# EAGLE design Simon (EAGLE 5.10)
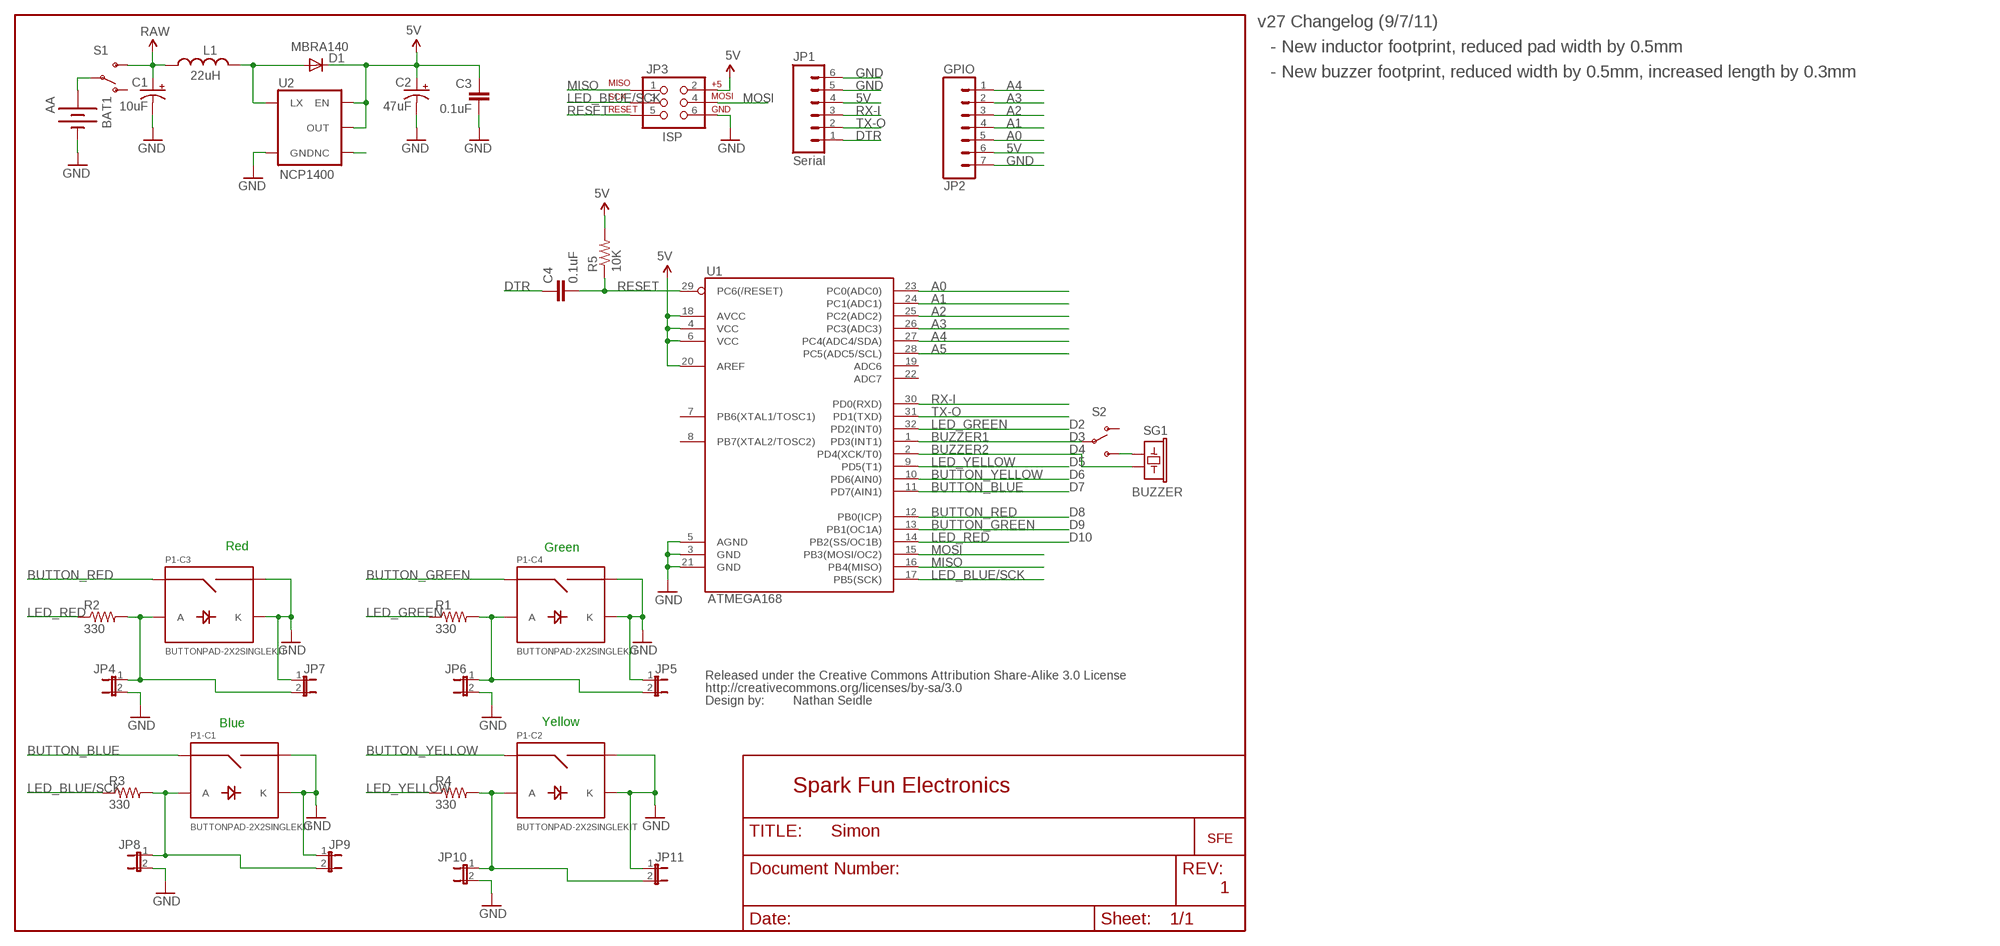
[diagram p0: schematic, sheet 1]

## Parts
BAT1  AA  BATTERYAA-KIT  [BATTERY-AA-KIT]
C1  10uF  CAP_POL1206-KIT  [EIA3216-KIT]
C2  47uF  CAP_POL3528-KIT  [EIA3528-KIT]
C3  0.1uF  CAP0603-CAP  [0603-CAP]
C4  0.1uF  CAP0603-CAP  [0603-CAP]
D1  MBRA140  DIODESMA-KIT  [SMA-DIODE-KIT]
JP1  Serial  M06SIP  [1X06]
JP2  GPIO  M07  [1X07]
JP3  ISP  AVR_SPI_PRG_6PTH  [2X3]
JP4  JUMPER-2SMD-NO-NS  [SJ_2S-NO-NS]
JP5  JUMPER-2NOSILK  [SJ_2S_NO_SILK]
JP6  JUMPER-2NOSILK  [SJ_2S_NO_SILK]
JP7  JUMPER-2SMD-NO-NS  [SJ_2S-NO-NS]
JP8  JUMPER-2SMD-NO-NS  [SJ_2S-NO-NS]
JP9  JUMPER-2SMD-NO-NS  [SJ_2S-NO-NS]
JP10  JUMPER-2NOSILK  [SJ_2S_NO_SILK]
JP11  JUMPER-2NOSILK  [SJ_2S_NO_SILK]
L1  22uH  INDUCTORCR54-KIT  [CR54-KIT]
P1-  BUTTONPAD-2X2SINGLEKIT  [BUTTONPAD-2X2SINGLE-KIT]
R1  330  RESISTOR0603-RES  [0603-RES]
R2  330  RESISTOR0603-RES  [0603-RES]
R3  330  RESISTOR0603-RES  [0603-RES]
R4  330  RESISTOR0603-RES  [0603-RES]
R5  10K  RESISTOR0603-RES  [0603-RES]
S1  SWITCH-SPSTKIT  [SWITCH-SPDT_KIT]
S2  SWITCH-SPSTKIT  [SWITCH-SPDT_KIT]
SG1  BUZZER  BUZZERSMD2-KIT  [BUZZER-CCV-KIT]
U1  ATMEGA168  [TQFP32-08]
U2  NCP1400  V-REG-NCP1400SOT23-5  [SOT23-5]
U$1  LOGO-SFENEW  [SFE-NEW-WEBLOGO]
U$2  CREATIVE_COMMONS  [CREATIVE_COMMONS]

## Nets
5V: C2.A(+) C3.1 D1.C JP1.4 JP2.6 JP3.2 R5.2 U1.4(VCC) U1.6(VCC) U1.18(AVCC) U1.20(AREF) U2.1(EN) U2.2(OUT)
A0: JP2.5 U1.23(PC0(ADC0))
A1: JP2.4 U1.24(PC1(ADC1))
A2: JP2.3 U1.25(PC2(ADC2))
A3: JP2.2 U1.26(PC3(ADC3))
A4: JP2.1 U1.27(PC4(ADC4/SDA))
A5: U1.28(PC5(ADC5/SCL))
BUTTON_BLUE [ButtonSignal]: P1-.SIG1(C1:SIG1) U1.11(PD7(AIN1))
BUTTON_GREEN: P1-.SIG7(C4:SIG1) U1.13(PB1(OC1A))
BUTTON_RED [ButtonSignal]: P1-.SIG5(C3:SIG1) U1.12(PB0(ICP))
BUTTON_YELLOW [ButtonSignal]: P1-.SIG3(C2:SIG1) U1.10(PD6(AIN0))
BUZZER1: S2.2(P) U1.1(PD3(INT1))
BUZZER2: SG1.- U1.2(PD4(XCK/T0))
DTR: C4.1 JP1.1
GND: BAT1.GND@1(-) C1.C(-) C2.C(-) C3.2 JP1.5 JP1.6 JP2.7 JP3.6 JP4.2 JP5.1 JP6.2 JP7.1 JP8.2 JP9.1 JP10.2 JP11.1 P1-.K1(C1:K) P1-.K2(C2:K) P1-.K3(C3:K) P1-.K4(C4:K) P1-.SIG2(C1:SIG2) P1-.SIG4(C2:SIG2) P1-.SIG6(C3:SIG2) P1-.SIG8(C4:SIG2) U1.3(GND) U1.5(AGND) U1.21(GND) U2.4(GND)
LED_BLUE/SCK: JP3.3 R3.1 U1.17(PB5(SCK))
LED_GREEN: R1.1 U1.32(PD2(INT0))
LED_RED: R2.1 U1.14(PB2(SS/OC1B))
LED_YELLOW: R4.1 U1.9(PD5(T1))
MISO: JP3.1 U1.16(PB4(MISO))
MOSI: JP3.4 U1.15(PB3(MOSI/OC2))
N$1: JP5.2 JP6.1 P1-.A4(C4:A) R1.2
N$2: BAT1.PWR@1(+) S1.2(P)
N$3: S2.3(S) SG1.+
N$4: JP10.1 JP11.2 P1-.A2(C2:A) R4.2
N$5: JP4.1 JP7.2 P1-.A3(C3:A) R2.2
N$6: JP8.1 JP9.2 P1-.A1(C1:A) R3.2
N$16: D1.A L1.P$1 U2.5(LX)
NC: U2.3(NC)
RAW: C1.A(+) L1.P$2 S1.3(S)
RESET: C4.2 JP3.5 R5.1 U1.29(PC6(/RESET))
RX-I: JP1.3 U1.30(PD0(RXD))
TX-O: JP1.2 U1.31(PD1(TXD))
Unconnected: S1.1(O) S2.1(O) U1.7(PB6(XTAL1/TOSC1)) U1.8(PB7(XTAL2/TOSC2)) U1.19(ADC6) U1.22(ADC7)

## Notes on the sheet
- v27 Changelog (9/7/11)
- - New inductor footprint, reduced pad width by 0.5mm
- - New buzzer footprint, reduced width by 0.5mm, increased length by 0.3mm
- D2
- D3
- D4
- D5
- D6
- D7
- D8
- D9
- D10
- Red | Green
- Nathan Seidle
- Blue | Yellow
- Spark Fun Electronics
- 1

## Library data of the parts
BAT1 = SparkFun:BATTERY: Battery Holders Various common sizes : AA, AAA, 20mm coin cell and 12mm coin cell.
C1 C2 = SparkFun:CAP_POL: Capacitor Polarized These are standard SMD and PTH capacitors. Normally 10uF, 47uF, and 100uF in electrolytic and tantalum varieties. Always verify the external diameter of the through hole cap, it varies with capacity, voltage, and manufacturer. The EIA devices should be standard.
C3 C4 = SparkFun:CAP: Capacitor Standard 0603 ceramic capacitor, and 0.1" leaded capacitor.
D1 = SparkFun:DIODE: Diode These are standard reverse protection diodes and small signal diodes. SMA package can handle up to about 1A. SOD-323 can handle about 200mA. What the SOD-323 package when ordering, there are some mfgs out there that are 5-pin packages.
JP1 = SparkFun:M06: Header 6 Standard 6-pin 0.1" header. Use with straight break away headers (SKU : PRT-00116), right angle break away headers (PRT-00553), swiss pins (PRT-00743), machine pins (PRT-00117), and female headers (PRT-00115). Molex polarized connector foot print use with SKU : PRT-08094 with associated crimp pins and housings. NOTES ON THE VARIANTS LOCK and LOCK_LONGPADS... This footprint was designed to help hold the alignment of a through-hole component (i.e. 6-pin header) while soldering it into place. You may notice that each hole has been shifted either up or down by 0.005 of an inch from it's more standard position (which is a perfectly straight line). This slight alteration caused the pins (the squares in the middle) to touch the edges of the holes. Because they are alternating, it causes a "brace" to hold the component in place. 0.005 has proven to be the perfect amount of "off-center" position when using our standard breakaway headers. Although looks a little odd when you look at the bare footprint, once you have a header in there, the alteration is very hard to notice. Also, if you push a header all the way into place, it is covered up entirely on the bottom side. This idea of altering the position of holes to aid alignment will be further integrated into the Sparkfun Library for other footprints. It can help hold any component with 3 or more connection pins.
JP2 = SparkFun:M07: Header 7 Standard 7-pin 0.1" header. Use with straight break away headers (SKU : PRT-00116), right angle break away headers (PRT-00553), swiss pins (PRT-00743), machine pins (PRT-00117), and female headers (PRT-00115). NOTES ON THE VARIANTS LOCK and LOCK_LONGPADS... This footprint was designed to help hold the alignment of a through-hole component (i.e. 7-pin header) while soldering it into place. You may notice that each hole has been shifted either up or down by 0.005 of an inch from it's more standard position (which is usually a perfectly straight line). This slight alteration caused the pins (the squares in the middle) to touch the edges of the holes. Because they are alternating, it causes a "brace" to hold the header in place. 0.005 has proven to be the perfect amount of "off-center" position when using our standard breakaway headers. Although looks a little odd when you look at the bare footprint, once you have a header in there, the alteration is very hard to notice. Also, if you push a header all the way into place, it is covered up entirely on the bottom side. This idea of altering the position of holes to aid alignment will be further integrated into the Sparkfun Library for other footprints. It can help hold any component with 3 or more connection pins.
JP3 = SparkFun:AVR_SPI_PRG_6: AVR ISP 6 Pin This is the reduced ISP connector for AVR programming. Common on Arduino. This footprint will take up less PCB space and can be used with a 10-pin to 6-pin adapter such as SKU: BOB-08508
JP4 JP7-JP9 = SparkFun:JUMPER-2: Jumper Basic 0.1" spaced jumper. Use with breakaway headers.
JP5 JP6 JP10 JP11 = unclepetes:JUMPER-2: Jumper Basic 0.1" spaced jumper. Use with breakaway headers.
L1 = SparkFun:INDUCTOR: Inductors Basic Inductor/Choke - 0603 and 1206. Footprints are not proven and vary greatly between part numbers.
P1- = SparkFun:BUTTONPAD-2X2SINGLE: 5mm Button Pad Proto layout and schematic for 2x2 button pad with single color LEDs (used on Simon board). Panelize this device/fp to a 4x4 pad if needed. Any single-color 5mm LED should be compatible. Spark Fun Electronics SKU : COM-07835.
R1-R5 = SparkFun:RESISTOR: Resistor Basic schematic elements and footprints for 0603, 1206, and PTH resistors.
S1 S2 = SparkFun:SWITCH-SPST: SPST Switch Simple slide switch. Spark Fun Electronics SKU : COM-00102
SG1 = SparkFun:BUZZER: Buzzer 12mm Spark Fun Electronics SKU : Comp-Buzzer
U1 = SparkFun:ATMEGA168
U2 = SparkFun-Nate:V-REG-NCP1400
U$1 = SparkFun:LOGO-SFE: Spark Fun Electronics PCB Logo This is the standard Spark Fun Electronics PCB logo.
U$2 = SparkFun:CREATIVE_COMMONS

## Net classes
0 Default: width 0.254 mm
1 Power: width 0.305 mm
3 ButtonSignal: width 0.203 mm

## Board
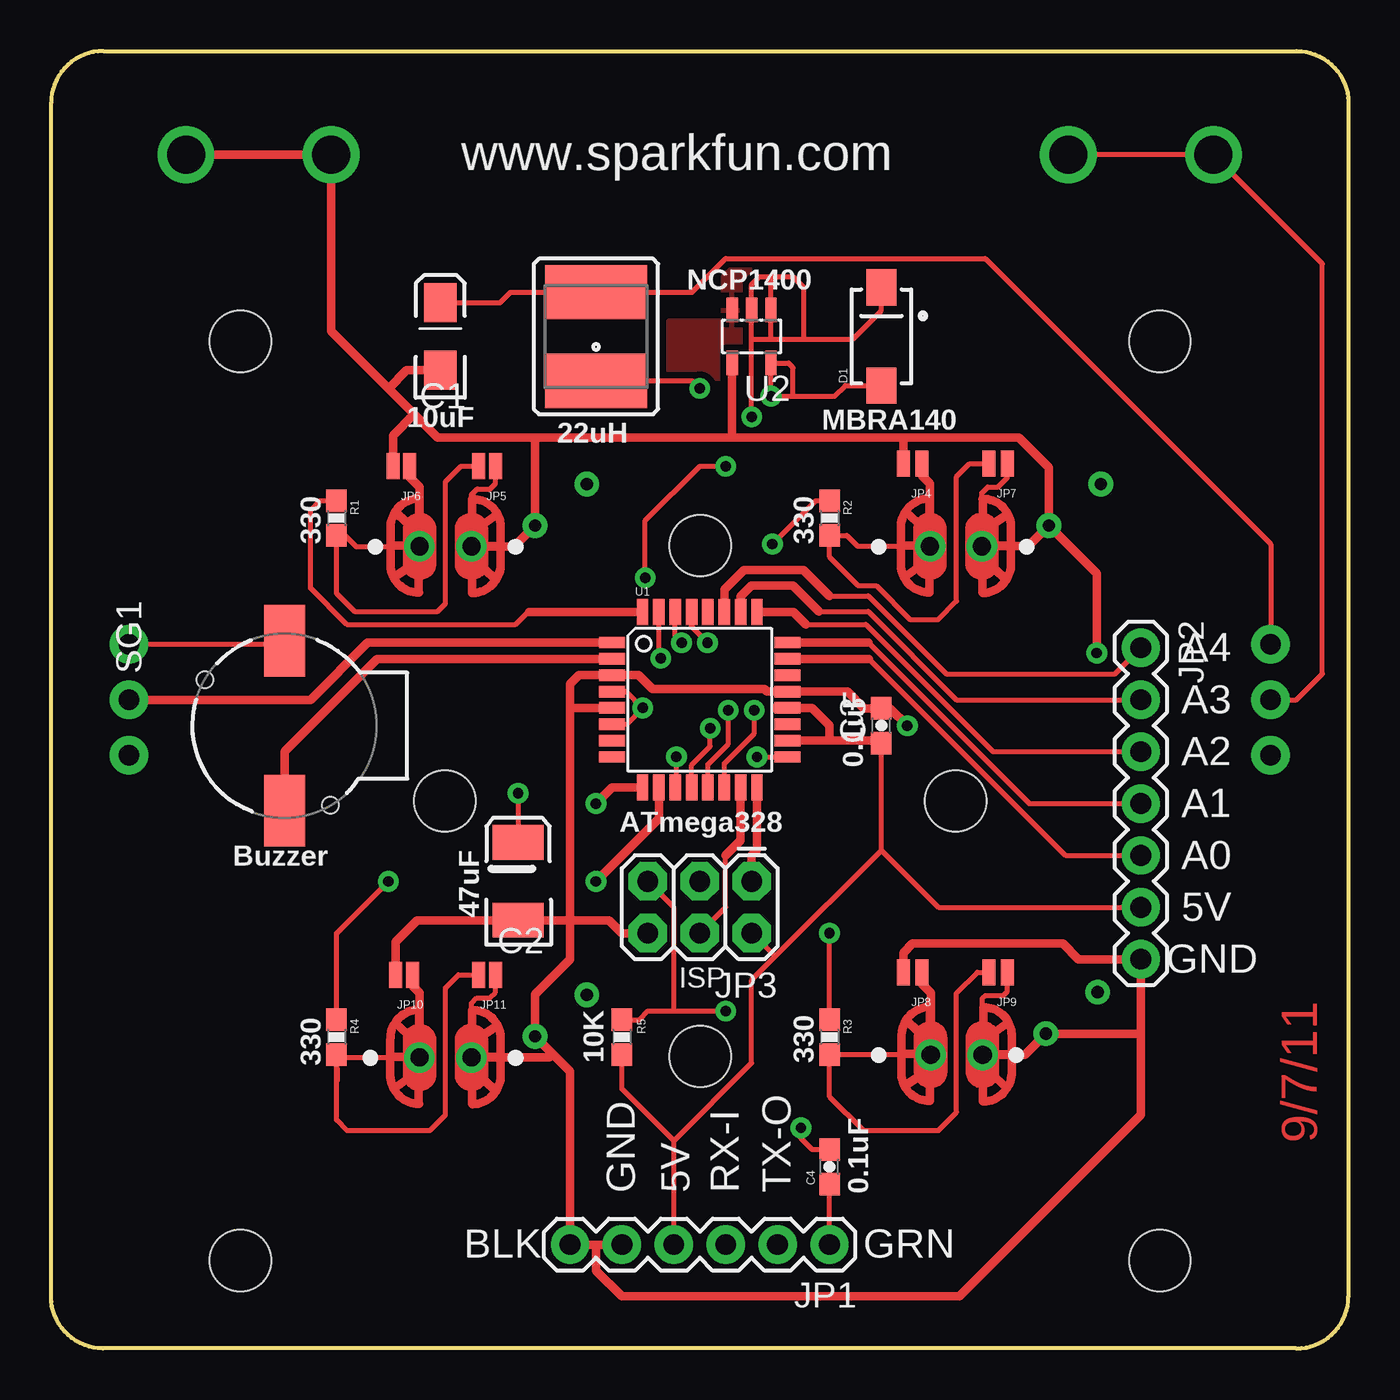
[diagram p1: board, top side]
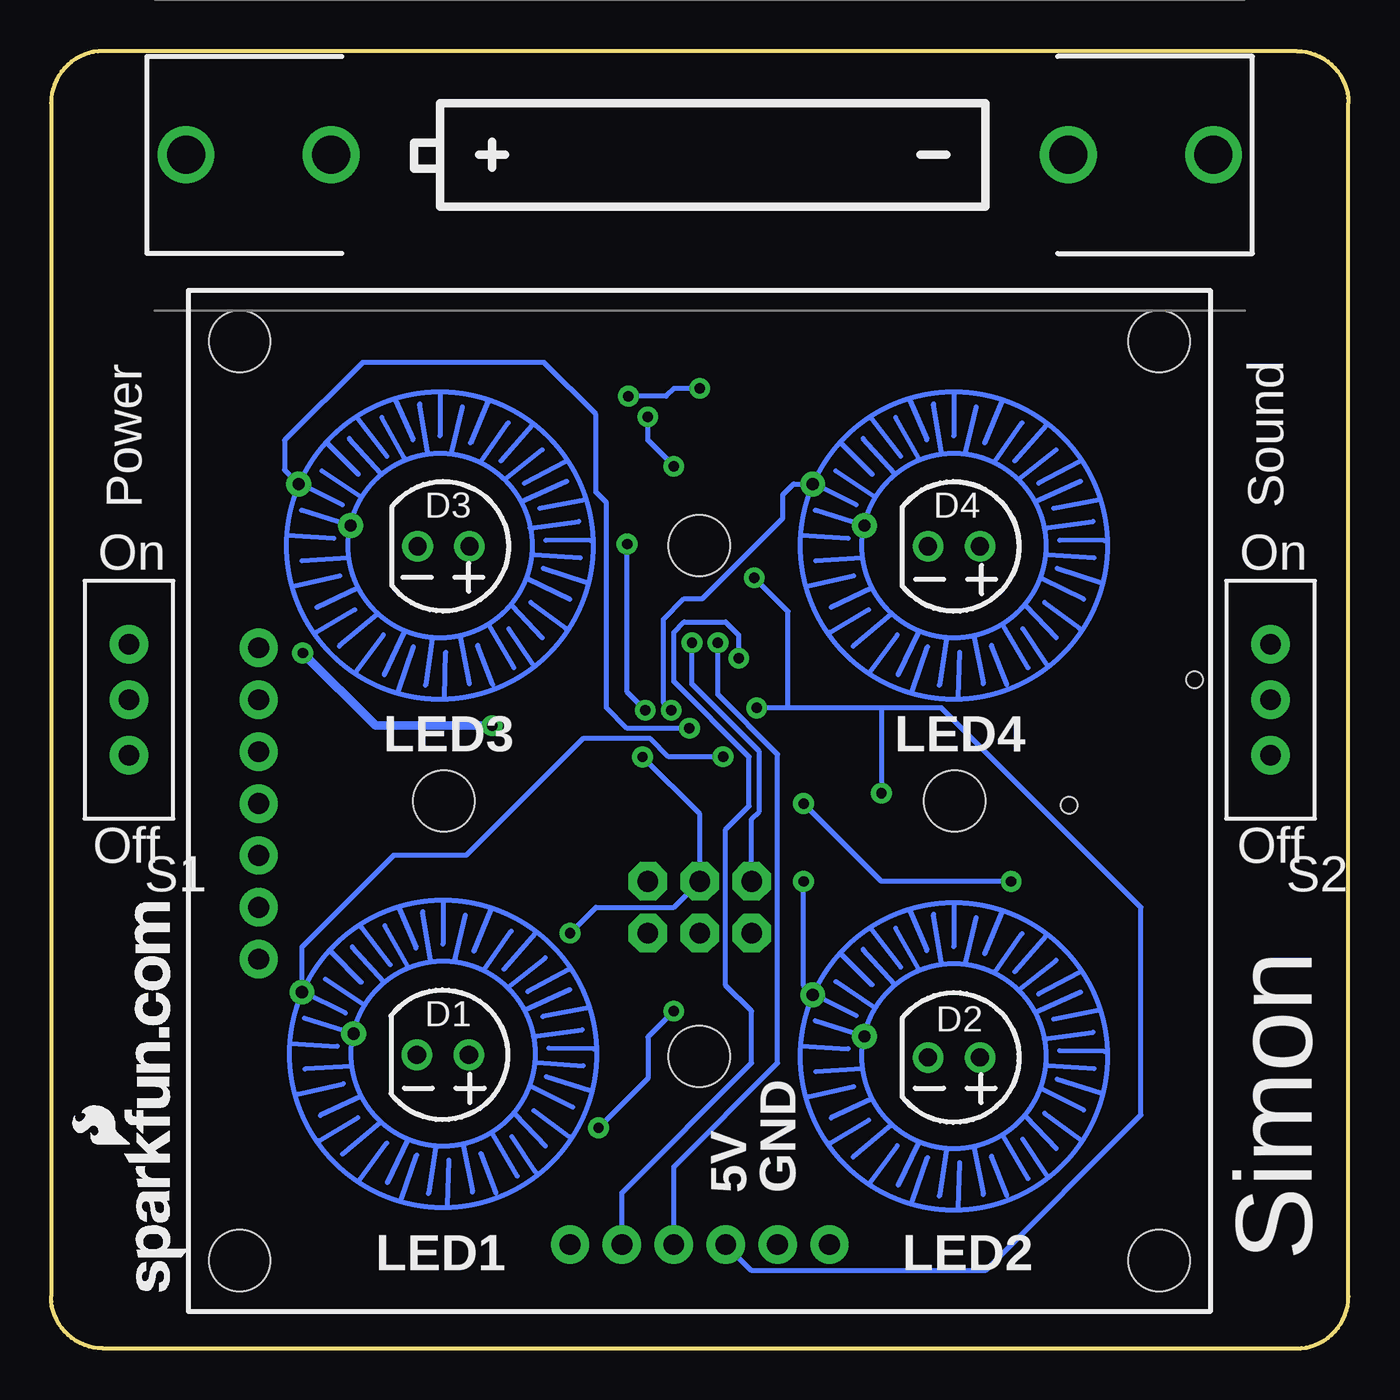
[diagram p2: board, bottom side, seen from below]

Size 63.5 x 63.5 mm. Coordinates in mm from the lower left corner, seen from the top.
Outline: 60.96,0 arc90 63.5,2.54 63.5,60.96 arc90 60.96,63.5 2.54,63.5 arc90 0,60.96 0,2.54 arc90 2.54,0 60.96,0
Copper layers (1*16): Top 0.035mm / dielectric 1.5mm / Bottom 0.035mm
Design rules "SparkFun *": minimum track width 8mil, minimum drill 20mil, track to track 8mil, track to pad 8mil, pad to pad 8mil, via to via 8mil, smd to smd 8mil, copper to edge 10mil, drill to drill 8mil, minimum pad ring 12mil, minimum via ring 10mil, stop-mask expansion 4mil, vias tented up to drill 25mil, thermal gap 10mil

### Footprints (pad centres in the part's own frame; a part is rotated, then mirrored left to right if it is on the bottom)
BATTERY-AA-KIT = drill 1.854 round: GND@1 25.146,0; GND@2 18.034,0; PWR@1 -25.146,0; PWR@2 -18.034,0
EIA3216-KIT = smd 1.9 x 1.6: A 1.65,0; C -1.65,0
EIA3528-KIT = smd 1.7 x 2.5: A 1.9,0; C -1.9,0
0603-CAP = smd 1.1 x 1: 1 -0.85,0; 2 0.85,0
SMA-DIODE-KIT = smd 1.77 x 1.47: A -2.4,0; C 2.4,0
1X06 = drill 1.016 pad 1.88 round: 1 0,0; 2 2.54,0; 3 5.08,0; 4 7.62,0; 5 10.16,0; 6 12.7,0
1X07 = drill 1.016 pad 1.88 round: 1 0,0; 2 2.54,0; 3 5.08,0; 4 7.62,0; 5 10.16,0; 6 12.7,0; 7 15.24,0
2X3 = drill 1.016 pad 1.88 octagon: 1 0,0; 2 0,2.54; 3 2.54,0; 4 2.54,2.54; 5 5.08,0; 6 5.08,2.54
SJ_2S-NO-NS = smd 0.635 x 1.27: 1 -0.45,0; 2 0.45,0
SJ_2S_NO_SILK = smd 0.635 x 1.27: 1 -0.412,0; 2 0.412,0
CR54-KIT = smd 5 x 2.65: P$1 0,2.17; P$2 0,-2.17
BUTTONPAD-2X2SINGLE-KIT = drill 0.889 pad 1.016 round: A1 13.716,12.573; A2 38.735,12.446; A3 13.75,37.47; A4 38.735,37.465; K1 11.176,12.573; K2 36.195,12.446; K3 11.21,37.47; K4 36.195,37.465 | drill 0.6 round: SIG1 5.542,15.64; SIG2 8.082,13.608; SIG3 30.542,15.513; SIG4 33.082,13.481; SIG5 5.388,40.513; SIG6 7.928,38.481; SIG7 30.542,40.513; SIG8 33.082,38.481 | hole 3: 12.5,25; 25,37.5; 37.5,25; 25,12.5; 2.5,2.5; 2.5,47.5; 47.5,47.5; 47.5,2.5
0603-RES = smd 1.1 x 1: 1 -0.85,0; 2 0.85,0
SWITCH-SPDT_KIT = drill 1.016 pad 1.88 round: 1 0,2.718; 2 0,0; 3 0,-2.718
BUZZER-CCV-KIT = smd 3.5 x 2: + 4.15,0; - -4.15,0 | hole 0.8: -3.9,-2.25; 2.25,3.9
TQFP32-08 = smd 1.27 x 0.559: 1 -4.293,2.8; 2 -4.293,2; 3 -4.293,1.2; 4 -4.293,0.4; 5 -4.293,-0.4; 6 -4.293,-1.2; 7 -4.293,-2; 8 -4.293,-2.8; 17 4.293,-2.8; 18 4.293,-2; 19 4.293,-1.2; 20 4.293,-0.4; 21 4.293,0.4; 22 4.293,1.2; 23 4.293,2; 24 4.293,2.8 | smd 0.559 x 1.27: 9 -2.8,-4.293; 10 -2,-4.293; 11 -1.2,-4.293; 12 -0.4,-4.293; 13 0.4,-4.293; 14 1.2,-4.293; 15 2,-4.293; 16 2.8,-4.293; 25 2.8,4.293; 26 2,4.293; 27 1.2,4.293; 28 0.4,4.293; 29 -0.4,4.293; 30 -1.2,4.293; 31 -2,4.293; 32 -2.8,4.293
SOT23-5 = smd 0.55 x 1.2: 1 -0.95,-1.3; 2 0,-1.3; 3 0.95,-1.3; 4 0.95,1.3; 5 -0.95,1.3

### Placement (x,y rotation side)
BAT1  31.75,58.42 0 bottom
C1  19.05,49.53 90 top
C2  22.86,22.86 90 top
C3  40.64,30.48 90 top
C4  38.1,8.89 90 top
D1  40.64,49.53 90 top
JP1  38.1,5.08 180 top
JP2  53.34,34.29 270 top
JP3  34.29,22.86 180 top
JP4  42.16,43.31 180 top
JP5  21.34,43.18 180 top
JP6  17.14,43.18 180 top
JP7  46.35,43.31 180 top
JP8  42.16,18.41 180 top
JP9  46.35,18.41 180 top
JP10  17.27,18.29 180 top
JP11  21.34,18.29 180 top
L1  26.67,49.53 180 top
P1-  56.77,1.79 0 bottom
R1  13.97,40.64 270 top
R2  38.1,40.64 270 top
R3  38.1,15.24 270 top
R4  13.97,15.24 270 top
R5  27.94,15.24 270 top
S1  59.69,31.75 180 bottom
S2  3.81,31.75 180 bottom
SG1  11.43,30.48 90 top
U1  31.75,31.75 0 top
U2  34.29,49.53 180 top
U$1  56.77,2.79 90 bottom
U$2  16.51,-16.51 0 top  (outside the outline)

### Tracks (layer width: path | path; a pad name or v marks a point on that pad's centre or on a via)
5V  (via drill 0.51)
  Top 0.254: D1.C 40.64,50.8 39.24,49.4 35.24,49.4 | v22.86,27.18 C2.A | v29.08,37.72 29.08,40.51 31.75,43.18 v33.02,43.18 | 35.41,31.35 U1.20 | U1.6 28.16,30.55 v28.96,31.35 28.16,32.15 U1.4 | 40.64,24.38 C3.1 | 35.43,19.18 40.64,24.38 | 35.43,19.18 JP3.2 | 35.18,52.45 36.32,52.45 36.83,51.94 36.83,49.4 | 35.18,52.45 34.67,52.45 34.29,52.07 U2.2 34.29,49.4 | 35.18,52.45 35.24,52.39 U2.1 35.24,49.4 | v34.29,45.59 34.29,49.4 | 34.29,49.4 35.24,49.4 | R5.2 27.94,12.7 30.48,10.16 | JP1.4 30.48,10.16 | 35.43,19.18 34.29,18.03 34.29,13.97 30.48,10.16 | 40.64,24.38 43.43,21.59 JP2.6
  Top 0.406: 38.1,29.75 40.52,29.75 C3.1 | 38.1,29.75 U1.18 | 35.41,31.35 37.23,31.35 38.1,30.48 38.1,29.75
  Bottom 0.254: v33.02,43.18 34.29,44.45 v34.29,45.59 | 27.43,31.35 v28.96,31.35 | v29.08,37.72 27.43,36.07 27.43,31.35 | JP1.4 29.21,3.81 17.78,3.81 10.16,11.43 10.16,21.59 19.92,31.35 22.86,31.35 | 22.86,31.35 27.43,31.35 | 22.86,31.35 v22.86,27.18
A0
  Top 0.254: JP2.5 49.66,24.13 40.04,33.75
  Top 0.406: U1.23 40.04,33.75
A1
  Top 0.254: JP2.4 47.88,26.67 40,34.55
  Top 0.406: U1.24 40,34.55
A2
  Top 0.254: JP2.3 46.1,29.21 39.88,35.43 36.96,35.43
  Top 0.406: U1.25 36.35,36.04 36.96,35.43
A3
  Top 0.254: JP2.2 44.32,31.75 40.01,36.07 37.59,36.07
  Top 0.406: U1.26 33.75,36.8 34.29,37.34 36.32,37.34 37.59,36.07
A4
  Top 0.254: JP2.1 52.07,33.02 43.81,33.02 40.01,36.83 38.1,36.83
  Top 0.406: U1.27 32.95,37.14 33.91,38.1 36.83,38.1 38.1,36.83
BUTTON_BLUE  (via drill 0.51)
  Top 0.254: U1.11 30.61,27.51 v30.61,28.96
  Bottom 0.254: P1-.SIG1 51.23,19.64 46.74,24.13 43.18,24.13 37.47,29.84 34.16,29.84 33.27,28.96 v30.61,28.96
BUTTON_GREEN  (via drill 0.51)
  Top 0.254: U1.13 32.15,28.59 33.15,29.59 v33.15,31.24
  Bottom 0.254: P1-.SIG7 27.16,42.31 27.69,41.78 27.69,40.64 31.62,36.7 32.51,36.7 33.53,35.69 33.53,31.62 v33.15,31.24
BUTTON_RED  (via drill 0.51)
  Top 0.254: v32.26,30.35 32.26,29.46 31.35,28.56 U1.12
  Bottom 0.254: P1-.SIG5 52.07,43 52.07,44.45 48.26,48.26 39.37,48.26 36.83,45.72 36.83,41.91 36.32,41.4 36.32,31.37 35.31,30.35 v32.26,30.35
BUTTON_YELLOW  (via drill 0.51)
  Top 0.406: U1.10 29.75,25.94 v26.67,22.86
  Bottom 0.254: v26.67,22.86 26.67,17.75 P1-.SIG3
BUZZER1
  Top 0.406: S2.2 12.7,31.75 15.5,34.55 U1.1
BUZZER2
  Top 0.406: U1.2 15.97,33.75 11.43,29.21 SG1.-
DTR
  Top 0.254: JP1.1 C4.1
GND  (via drill 0.51)
  Top 0.254: P1-.K4 20.57,41.78 20.86,42.07 21.49,42.07 21.75,42.32 JP5.1 | P1-.K3 45.56,41.88 45.85,42.16 46.35,42.16 46.8,42.61 JP7.1 | P1-.K2 20.57,16.89 20.83,17.14 21.46,17.14 21.75,17.43 JP11.1 | P1-.K1 45.59,17.14 45.72,17.27 46.61,17.27 46.8,17.47 JP9.1
  Top 0.406: 41.66,44.58 47.37,44.58 48.84,43.11 P1-.SIG6 | 33.34,44.58 U2.4 | P1-.K3 47.83,39.26 P1-.SIG6 | JP3.6 27.94,20.32 27.31,20.96 25.4,20.96 | 25.4,20.96 C2.C 17.91,20.96 16.86,19.91 JP10.2 | 26.67,5.08 JP1.6 25.4,13.56 24.56,14.4 | 26.67,5.08 JP1.5 | 24.56,14.4 P1-.SIG4 23.69,17.34 25.4,19.05 25.4,20.96 | 53.34,15.37 53.34,11.43 44.45,2.54 27.94,2.54 26.67,3.81 26.67,5.08 | 53.34,15.37 JP2.7 50.29,19.05 49.53,19.81 42.16,19.81 41.71,19.36 JP8.2 | 53.34,15.37 53.3,15.4 P1-.SIG2 47.65,14.37 P1-.K1 | BAT1.GND@1 13.72,58.42 13.72,49.78 16.51,46.99 | 17.78,45.72 18.92,44.58 23.24,44.58 | 17.78,45.72 16.51,46.99 | 25.4,20.96 25.4,31.24 | U1.5 25.51,31.35 25.4,31.24 | 25.4,31.24 25.4,32.51 25.84,32.95 U1.3 28.76,32.95 29.43,32.28 34.91,32.28 35.03,32.15 U1.21 38.97,32.15 39.79,31.33 C3.2 41.06,31.33 v41.91,30.48 | P1-.K4 22.67,39.26 P1-.SIG8 23.69,44.52 23.75,44.58 | P1-.K2 24.4,14.24 24.56,14.4 | v51.18,34.04 51.18,37.94 P1-.SIG6 | JP6.2 16.73,44.67 17.78,45.72 | 23.24,44.58 23.5,44.58 | 23.75,44.58 23.24,44.58 | 33.34,44.58 23.75,44.58 | 41.66,44.58 33.34,44.58 | JP4.2 41.71,44.52 41.66,44.58 | C1.C 17.4,47.88 16.51,46.99
  Bottom 0.406: v51.18,34.04 47.62,30.48 v41.91,30.48
LED_BLUE/SCK  (via drill 0.51)
  Top 0.254: v34.55,28.95 U1.17 | R3.1 v38.1,20.32
  Bottom 0.254: v38.1,20.32 36.83,21.59 33.02,21.59 JP3.3 31.75,26.15 v34.55,28.95
LED_GREEN
  Top 0.254: R1.1 13.17,41.49 12.7,41.02 12.7,37.21 14.48,35.43 22.73,35.43 23.34,36.04 23.39,36.04
  Top 0.406: 23.39,36.04 U1.32
LED_RED  (via drill 0.51)
  Top 0.254: U1.14 32.95,28.63 34.42,30.1 v34.42,31.24 | R2.1 37.43,41.49 v35.31,39.37
  Bottom 0.254: v34.42,31.24 35.31,32.13 v35.31,39.37
LED_YELLOW  (via drill 0.51)
  Top 0.254: v16.51,22.86 13.97,20.32 R4.1
  Top 0.406: U1.9 27.46,27.46 v26.67,26.67
  Bottom 0.254: v16.51,22.86 22.86,22.86 v26.67,26.67
MISO
  Top 0.406: U1.16 34.55,24.39 34.29,24.13 JP3.1
MOSI
  Top 0.254: 33.02,24.13 33.02,21.59 JP3.4
  Top 0.406: U1.15 33.75,24.86 33.02,24.13
N$1
  Top 0.254: P1-.A4 18.02,39.24 14.94,39.24 14.39,39.79 R1.2 13.97,36.96 14.86,36.07 18.92,36.07 19.3,36.45 19.3,42.42 20.07,43.18 JP5.2
  Top 0.406: P1-.A4 18.03,42.16 17.56,42.64 JP6.1
N$2
  Top 0.254: S1.2 60.96,31.75 62.23,33.02 62.23,53.09 BAT1.PWR@1 49.78,58.42
N$3
  Top 0.254: SG1.+ 11.42,34.47 S2.3
N$4
  Top 0.254: R4.2 14.01,13.12 | R4.2 13.97,11.18 14.48,10.67 18.54,10.67 19.3,11.43 19.3,17.65 19.94,18.29 JP11.2 | P1-.A2 14.12,14.24 R4.2
  Top 0.406: P1-.A2 18.03,17.4 17.68,17.75 JP10.1
N$5
  Top 0.254: JP7.2 44.96,43.31 44.32,42.67 44.32,36.58 43.43,35.69 42.04,35.69 40.39,37.34 39.5,37.34 38.1,38.73 R2.2 38.95,39.79 39.48,39.26 P1-.A3
  Top 0.406: P1-.A3 43.02,42.33 42.61,42.73 JP4.1
N$6
  Top 0.254: P1-.A1 43.03,14.39 R3.2 38.1,12.32 39.75,10.67 43.43,10.67 44.32,11.56 44.32,17.4 45.34,18.41 JP9.2
  Top 0.406: P1-.A1 43.05,17.4 42.61,17.84 JP8.1
N$16  (via drill 0.51)
  Top 0.254: L1.P$1 31.38,47.36 v31.75,46.99 | D1.A 38.88,47.13 38.35,46.61 36.32,46.61 | 36.32,46.61 v35.24,46.61 U2.5 36.1,48.23 36.32,48.01 36.32,46.61
  Bottom 0.254: v31.75,46.99 33.02,46.99 33.4,46.61 v35.24,46.61
NC
  pour Top (isolate 0.305): 32.89,53.34 32.89,50.29 30.23,50.29 30.23,47.5 34.29,47.5 34.29,53.34
RAW
  Top 0.254: S1.3 59.69,39.37 45.72,53.34 33.02,53.34 31.38,51.7 L1.P$2 22.49,51.7 21.97,51.18 C1.A
RESET  (via drill 0.51)
  Top 0.254: U1.29 31.35,35.33 v32.13,34.54 | JP3.5 30.48,21.59 30.48,16.51 | C4.2 37.25,9.74 36.7,10.29 v36.7,10.79 | 30.48,16.51 29.21,16.51 28.79,16.09 R5.1 | 30.48,16.51 v33.02,16.51
  Bottom 0.254: v32.13,34.54 32.13,32.51 28.83,29.21 28.83,26.29 29.21,25.91 JP3.5 | v36.7,10.79 34.29,13.21 34.29,15.24 v33.02,16.51
RX-I  (via drill 0.51)
  Top 0.254: U1.30 30.55,34.85 v30.86,34.54
  Bottom 0.254: JP1.3 33.02,8.89 27.94,13.97 27.94,29.08 30.86,32 v30.86,34.54
TX-O  (via drill 0.51)
  Top 0.254: U1.31 29.75,33.88 v29.84,33.78
  Bottom 0.254: JP1.2 35.56,7.62 29.21,13.97 29.21,16.51 30.48,17.78 30.48,25.4 29.34,26.54 29.34,28.96 33.02,32.64 33.02,35.05 32.51,35.56 30.48,35.56 29.84,34.92 v29.84,33.78

### Text on the board
Top: 9/7/11
tPlace: www.sparkfun.com | NCP1400 | 10uF | MBRA140 | 22uH | 330 | 330 | A4 | A3 | A2 | 0.1uF | A1 | ATmega328 | A0 | Buzzer | 5V | 47uF | GND | ISP | 330 | 10K | 330 | 0.1uF | GND | 5V | RX-I | TX-O | BLK | GRN
bPlace: Sound | D4 | D3 | Power | On | On | LED4 | LED3 | Off | Off | D1 | D2 | GND | 5V | Simon | LED2 | LED1
tValues: Clips point inwards to accept AA battery | Clip | Clip | Make sure long leg goes to the round side | Top Side Components | All thru hole components make joint on bottom
bValues: Clips do not go on this side | Power Supply | 22uH | Sound | Controller | Serial | Bottom Side Components | All thru hole components make joint on top side
wert: Power Supply | LED | Controller